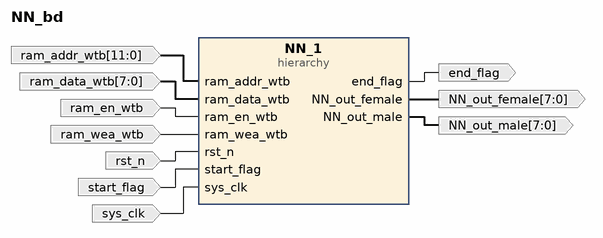
[diagram p0: block diagram of the top level]
# Vivado block design NN_bd, xc7z020clg400-1, Vivado 2021.2
create_bd_design NN_bd

create_bd_port -dir I start_flag
create_bd_port -dir I sys_clk
create_bd_port -dir I rst_n
create_bd_port -dir O end_flag
create_bd_port -dir O -from 7 -to 0 NN_out_female
create_bd_port -dir O -from 7 -to 0 NN_out_male
create_bd_port -dir I ram_wea_wtb
create_bd_port -dir I ram_en_wtb
create_bd_port -dir I -from 7 -to 0 ram_data_wtb
create_bd_port -dir I -from 11 -to 0 ram_addr_wtb

create_bd_cell -type hier NN_1

# ---- hierarchy /NN_1 ----
current_bd_instance /NN_1
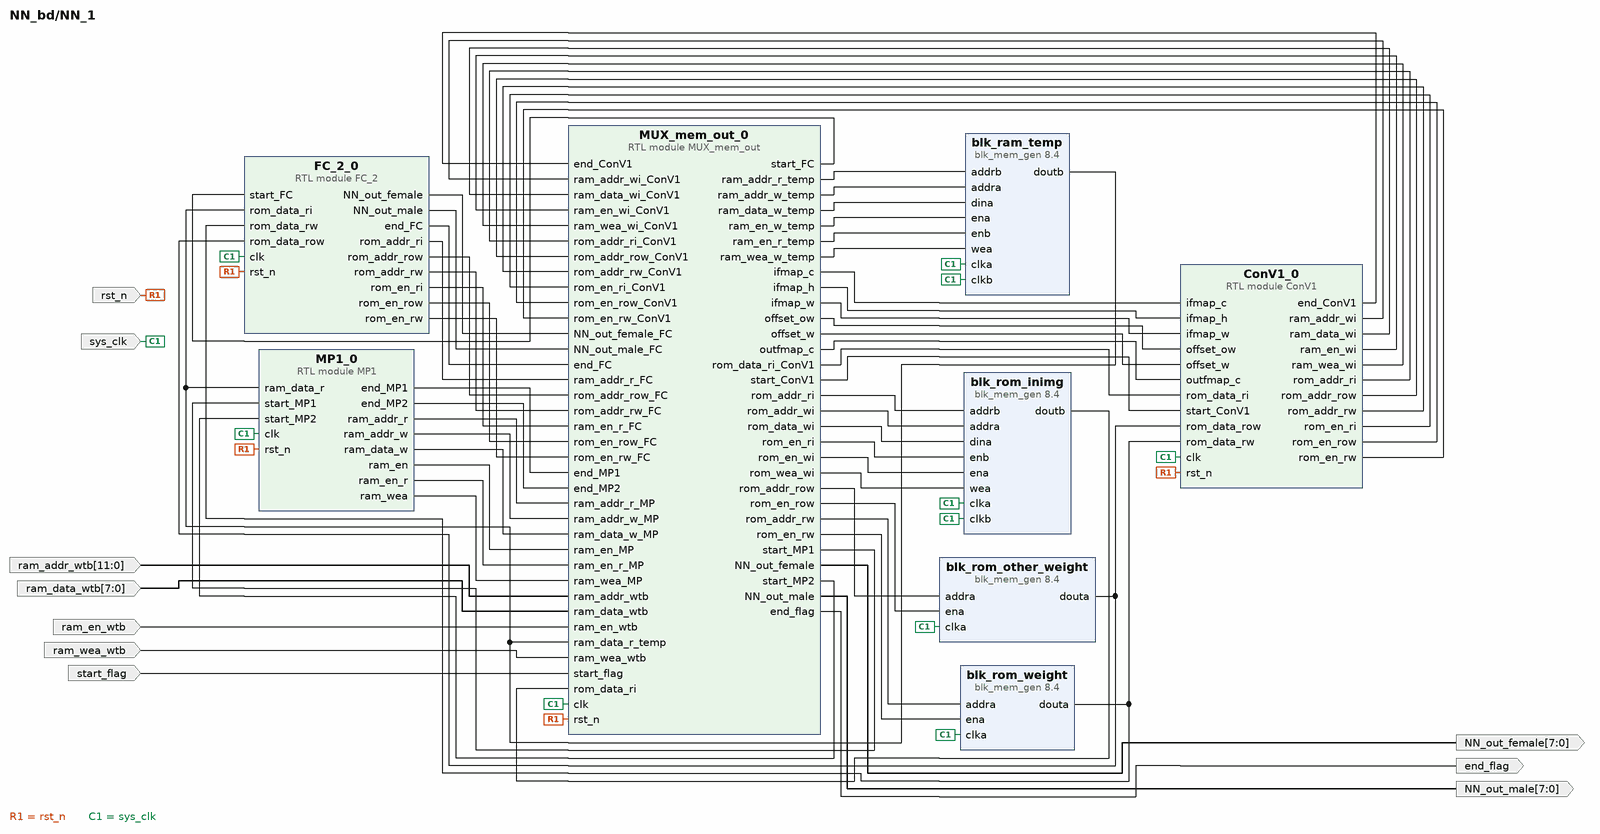
[diagram p1: block diagram inside /NN_1]
create_bd_pin -dir I sys_clk
create_bd_pin -dir I rst_n
create_bd_pin -dir I start_flag
create_bd_pin -dir O end_flag
create_bd_pin -dir O -from 7 -to 0 NN_out_female
create_bd_pin -dir O -from 7 -to 0 NN_out_male
create_bd_pin -dir I -from 11 -to 0 ram_addr_wtb
create_bd_pin -dir I -from 7 -to 0 ram_data_wtb
create_bd_pin -dir I ram_en_wtb
create_bd_pin -dir I ram_wea_wtb

create_bd_cell -type ip -vlnv xilinx.com:ip:blk_mem_gen:8.4 blk_ram_temp
set_property -dict [list \
  CONFIG.Enable_32bit_Address false \
  CONFIG.Enable_B Use_ENB_Pin \
  CONFIG.Memory_Type Simple_Dual_Port_RAM \
  CONFIG.Operating_Mode_A NO_CHANGE \
  CONFIG.Port_B_Clock 100 \
  CONFIG.Port_B_Enable_Rate 100 \
  CONFIG.Read_Width_B 8 \
  CONFIG.Register_PortB_Output_of_Memory_Primitives true \
  CONFIG.Use_Byte_Write_Enable false \
  CONFIG.Write_Depth_A 65536 \
  CONFIG.Write_Width_A 8 \
  CONFIG.Write_Width_B 8 \
  CONFIG.use_bram_block Stand_Alone \
] [get_bd_cells blk_ram_temp]
create_bd_cell -type ip -vlnv xilinx.com:ip:blk_mem_gen:8.4 blk_rom_inimg
set_property -dict [list \
  CONFIG.Enable_32bit_Address false \
  CONFIG.Enable_B Use_ENB_Pin \
  CONFIG.Load_Init_File false \
  CONFIG.Memory_Type Simple_Dual_Port_RAM \
  CONFIG.Operating_Mode_A NO_CHANGE \
  CONFIG.Port_B_Clock 100 \
  CONFIG.Port_B_Enable_Rate 100 \
  CONFIG.Read_Width_B 8 \
  CONFIG.Register_PortB_Output_of_Memory_Primitives true \
  CONFIG.Use_Byte_Write_Enable false \
  CONFIG.Write_Depth_A 65536 \
  CONFIG.Write_Width_A 8 \
  CONFIG.Write_Width_B 8 \
  CONFIG.use_bram_block Stand_Alone \
] [get_bd_cells blk_rom_inimg]
create_bd_cell -type ip -vlnv xilinx.com:ip:blk_mem_gen:8.4 blk_rom_weight
set_property -dict [list \
  CONFIG.Coe_File {../../../../../../../CNN_information/coe file/weight.coe} \
  CONFIG.Enable_32bit_Address false \
  CONFIG.Load_Init_File true \
  CONFIG.Memory_Type Single_Port_ROM \
  CONFIG.Port_A_Write_Rate 0 \
  CONFIG.Register_PortA_Output_of_Memory_Primitives true \
  CONFIG.Use_RSTA_Pin false \
  CONFIG.Write_Depth_A 32768 \
  CONFIG.Write_Width_A 8 \
  CONFIG.use_bram_block Stand_Alone \
] [get_bd_cells blk_rom_weight]
create_bd_cell -type ip -vlnv xilinx.com:ip:blk_mem_gen:8.4 blk_rom_other_weight
set_property -dict [list \
  CONFIG.Coe_File {../../../../../../../CNN_information/coe file/M0_bias.coe} \
  CONFIG.Enable_32bit_Address false \
  CONFIG.Load_Init_File true \
  CONFIG.Memory_Type Single_Port_ROM \
  CONFIG.Port_A_Write_Rate 0 \
  CONFIG.Register_PortA_Output_of_Memory_Primitives true \
  CONFIG.Use_RSTA_Pin false \
  CONFIG.Write_Depth_A 512 \
  CONFIG.use_bram_block Stand_Alone \
] [get_bd_cells blk_rom_other_weight]
create_bd_cell -type module -reference MP1 MP1_0
create_bd_cell -type module -reference MUX_mem_out MUX_mem_out_0
create_bd_cell -type module -reference ConV1 ConV1_0
create_bd_cell -type module -reference FC_2 FC_2_0

# ---- connections ----

current_bd_instance /NN_1
connect_bd_net [get_bd_pins ConV1_0/end_ConV1] [get_bd_pins MUX_mem_out_0/end_ConV1]
connect_bd_net [get_bd_pins ConV1_0/ram_addr_wi] [get_bd_pins MUX_mem_out_0/ram_addr_wi_ConV1]
connect_bd_net [get_bd_pins ConV1_0/ram_data_wi] [get_bd_pins MUX_mem_out_0/ram_data_wi_ConV1]
connect_bd_net [get_bd_pins ConV1_0/ram_en_wi] [get_bd_pins MUX_mem_out_0/ram_en_wi_ConV1]
connect_bd_net [get_bd_pins ConV1_0/ram_wea_wi] [get_bd_pins MUX_mem_out_0/ram_wea_wi_ConV1]
connect_bd_net [get_bd_pins ConV1_0/rom_addr_ri] [get_bd_pins MUX_mem_out_0/rom_addr_ri_ConV1]
connect_bd_net [get_bd_pins ConV1_0/rom_addr_row] [get_bd_pins MUX_mem_out_0/rom_addr_row_ConV1]
connect_bd_net [get_bd_pins ConV1_0/rom_addr_rw] [get_bd_pins MUX_mem_out_0/rom_addr_rw_ConV1]
connect_bd_net [get_bd_pins ConV1_0/rom_en_ri] [get_bd_pins MUX_mem_out_0/rom_en_ri_ConV1]
connect_bd_net [get_bd_pins ConV1_0/rom_en_row] [get_bd_pins MUX_mem_out_0/rom_en_row_ConV1]
connect_bd_net [get_bd_pins ConV1_0/rom_en_rw] [get_bd_pins MUX_mem_out_0/rom_en_rw_ConV1]
connect_bd_net [get_bd_pins FC_2_0/NN_out_female] [get_bd_pins MUX_mem_out_0/NN_out_female_FC]
connect_bd_net [get_bd_pins FC_2_0/NN_out_male] [get_bd_pins MUX_mem_out_0/NN_out_male_FC]
connect_bd_net [get_bd_pins FC_2_0/end_FC] [get_bd_pins MUX_mem_out_0/end_FC]
connect_bd_net [get_bd_pins FC_2_0/rom_addr_ri] [get_bd_pins MUX_mem_out_0/ram_addr_r_FC]
connect_bd_net [get_bd_pins FC_2_0/rom_addr_row] [get_bd_pins MUX_mem_out_0/rom_addr_row_FC]
connect_bd_net [get_bd_pins FC_2_0/rom_addr_rw] [get_bd_pins MUX_mem_out_0/rom_addr_rw_FC]
connect_bd_net [get_bd_pins FC_2_0/rom_en_ri] [get_bd_pins MUX_mem_out_0/ram_en_r_FC]
connect_bd_net [get_bd_pins FC_2_0/rom_en_row] [get_bd_pins MUX_mem_out_0/rom_en_row_FC]
connect_bd_net [get_bd_pins FC_2_0/rom_en_rw] [get_bd_pins MUX_mem_out_0/rom_en_rw_FC]
connect_bd_net [get_bd_pins MP1_0/end_MP1] [get_bd_pins MUX_mem_out_0/end_MP1]
connect_bd_net [get_bd_pins MP1_0/end_MP2] [get_bd_pins MUX_mem_out_0/end_MP2]
connect_bd_net [get_bd_pins MP1_0/ram_addr_r] [get_bd_pins MUX_mem_out_0/ram_addr_r_MP]
connect_bd_net [get_bd_pins MP1_0/ram_addr_w] [get_bd_pins MUX_mem_out_0/ram_addr_w_MP]
connect_bd_net [get_bd_pins MP1_0/ram_data_w] [get_bd_pins MUX_mem_out_0/ram_data_w_MP]
connect_bd_net [get_bd_pins MP1_0/ram_en] [get_bd_pins MUX_mem_out_0/ram_en_MP]
connect_bd_net [get_bd_pins MP1_0/ram_en_r] [get_bd_pins MUX_mem_out_0/ram_en_r_MP]
connect_bd_net [get_bd_pins MP1_0/ram_wea] [get_bd_pins MUX_mem_out_0/ram_wea_MP]
connect_bd_net [get_bd_pins MUX_mem_out_0/NN_out_female] [get_bd_pins NN_out_female]
connect_bd_net [get_bd_pins MUX_mem_out_0/NN_out_male] [get_bd_pins NN_out_male]
connect_bd_net [get_bd_pins MUX_mem_out_0/end_flag] [get_bd_pins end_flag]
connect_bd_net [get_bd_pins MUX_mem_out_0/ifmap_c] [get_bd_pins ConV1_0/ifmap_c]
connect_bd_net [get_bd_pins MUX_mem_out_0/ifmap_h] [get_bd_pins ConV1_0/ifmap_h]
connect_bd_net [get_bd_pins MUX_mem_out_0/ifmap_w] [get_bd_pins ConV1_0/ifmap_w]
connect_bd_net [get_bd_pins MUX_mem_out_0/offset_ow] [get_bd_pins ConV1_0/offset_ow]
connect_bd_net [get_bd_pins MUX_mem_out_0/offset_w] [get_bd_pins ConV1_0/offset_w]
connect_bd_net [get_bd_pins MUX_mem_out_0/outfmap_c] [get_bd_pins ConV1_0/outfmap_c]
connect_bd_net -net MUX_mem_out_0_ram_addr_r [get_bd_pins MUX_mem_out_0/ram_addr_r_temp] [get_bd_pins blk_ram_temp/addrb]
connect_bd_net -net MUX_mem_out_0_ram_addr_w [get_bd_pins MUX_mem_out_0/ram_addr_w_temp] [get_bd_pins blk_ram_temp/addra]
connect_bd_net -net MUX_mem_out_0_ram_data_w [get_bd_pins MUX_mem_out_0/ram_data_w_temp] [get_bd_pins blk_ram_temp/dina]
connect_bd_net -net MUX_mem_out_0_ram_en [get_bd_pins MUX_mem_out_0/ram_en_w_temp] [get_bd_pins blk_ram_temp/ena]
connect_bd_net -net MUX_mem_out_0_ram_en_r [get_bd_pins MUX_mem_out_0/ram_en_r_temp] [get_bd_pins blk_ram_temp/enb]
connect_bd_net -net MUX_mem_out_0_ram_wea [get_bd_pins MUX_mem_out_0/ram_wea_w_temp] [get_bd_pins blk_ram_temp/wea]
connect_bd_net [get_bd_pins MUX_mem_out_0/rom_addr_ri] [get_bd_pins blk_rom_inimg/addrb]
connect_bd_net [get_bd_pins MUX_mem_out_0/rom_addr_row] [get_bd_pins blk_rom_other_weight/addra]
connect_bd_net [get_bd_pins MUX_mem_out_0/rom_addr_rw] [get_bd_pins blk_rom_weight/addra]
connect_bd_net [get_bd_pins MUX_mem_out_0/rom_addr_wi] [get_bd_pins blk_rom_inimg/addra]
connect_bd_net [get_bd_pins MUX_mem_out_0/rom_data_ri_ConV1] [get_bd_pins ConV1_0/rom_data_ri]
connect_bd_net [get_bd_pins MUX_mem_out_0/rom_data_wi] [get_bd_pins blk_rom_inimg/dina]
connect_bd_net [get_bd_pins MUX_mem_out_0/rom_en_ri] [get_bd_pins blk_rom_inimg/enb]
connect_bd_net [get_bd_pins MUX_mem_out_0/rom_en_row] [get_bd_pins blk_rom_other_weight/ena]
connect_bd_net [get_bd_pins MUX_mem_out_0/rom_en_rw] [get_bd_pins blk_rom_weight/ena]
connect_bd_net [get_bd_pins MUX_mem_out_0/rom_en_wi] [get_bd_pins blk_rom_inimg/ena]
connect_bd_net [get_bd_pins MUX_mem_out_0/rom_wea_wi] [get_bd_pins blk_rom_inimg/wea]
connect_bd_net [get_bd_pins MUX_mem_out_0/start_ConV1] [get_bd_pins ConV1_0/start_ConV1]
connect_bd_net [get_bd_pins MUX_mem_out_0/start_FC] [get_bd_pins FC_2_0/start_FC]
connect_bd_net [get_bd_pins MUX_mem_out_0/start_MP1] [get_bd_pins MP1_0/start_MP1]
connect_bd_net [get_bd_pins MUX_mem_out_0/start_MP2] [get_bd_pins MP1_0/start_MP2]
connect_bd_net -net blk_mem_gen_0_douta [get_bd_pins blk_rom_weight/douta] [get_bd_pins ConV1_0/rom_data_rw] [get_bd_pins FC_2_0/rom_data_rw]
connect_bd_net -net blk_ram_temp_value_doutb [get_bd_pins blk_ram_temp/doutb] \
  [get_bd_pins MP1_0/ram_data_r] [get_bd_pins MUX_mem_out_0/ram_data_r_temp] [get_bd_pins FC_2_0/rom_data_ri]
connect_bd_net [get_bd_pins blk_rom_inimg/doutb] [get_bd_pins MUX_mem_out_0/rom_data_ri]
connect_bd_net [get_bd_pins blk_rom_other_weight/douta] [get_bd_pins ConV1_0/rom_data_row] [get_bd_pins FC_2_0/rom_data_row]
connect_bd_net [get_bd_pins ram_addr_wtb] [get_bd_pins MUX_mem_out_0/ram_addr_wtb]
connect_bd_net [get_bd_pins ram_data_wtb] [get_bd_pins MUX_mem_out_0/ram_data_wtb]
connect_bd_net [get_bd_pins ram_en_wtb] [get_bd_pins MUX_mem_out_0/ram_en_wtb]
connect_bd_net [get_bd_pins ram_wea_wtb] [get_bd_pins MUX_mem_out_0/ram_wea_wtb]
connect_bd_net [get_bd_pins rst_n] [get_bd_pins MP1_0/rst_n] [get_bd_pins MUX_mem_out_0/rst_n] [get_bd_pins ConV1_0/rst_n] [get_bd_pins FC_2_0/rst_n]
connect_bd_net [get_bd_pins start_flag] [get_bd_pins MUX_mem_out_0/start_flag]
connect_bd_net [get_bd_pins sys_clk] \
  [get_bd_pins blk_ram_temp/clkb] [get_bd_pins blk_ram_temp/clka] [get_bd_pins blk_rom_other_weight/clka] \
  [get_bd_pins blk_rom_inimg/clkb] [get_bd_pins blk_rom_weight/clka] [get_bd_pins blk_rom_inimg/clka] [get_bd_pins MP1_0/clk] \
  [get_bd_pins MUX_mem_out_0/clk] [get_bd_pins ConV1_0/clk] [get_bd_pins FC_2_0/clk]

current_bd_instance /
connect_bd_net -net MUX_mem_out_0_NN_out_female [get_bd_pins NN_1/NN_out_female] [get_bd_ports NN_out_female]
connect_bd_net -net MUX_mem_out_0_NN_out_male [get_bd_pins NN_1/NN_out_male] [get_bd_ports NN_out_male]
connect_bd_net -net MUX_mem_out_0_end_flag [get_bd_pins NN_1/end_flag] [get_bd_ports end_flag]
connect_bd_net [get_bd_ports ram_addr_wtb] [get_bd_pins NN_1/ram_addr_wtb]
connect_bd_net [get_bd_ports ram_data_wtb] [get_bd_pins NN_1/ram_data_wtb]
connect_bd_net [get_bd_ports ram_en_wtb] [get_bd_pins NN_1/ram_en_wtb]
connect_bd_net [get_bd_ports ram_wea_wtb] [get_bd_pins NN_1/ram_wea_wtb]
connect_bd_net [get_bd_ports rst_n] [get_bd_pins NN_1/rst_n]
connect_bd_net [get_bd_ports start_flag] [get_bd_pins NN_1/start_flag]
connect_bd_net [get_bd_ports sys_clk] [get_bd_pins NN_1/sys_clk]

validate_bd_design
save_bd_design
